# Altium schematic sheet Nahid's.SchDoc
size A3; SheetNumber: 1; SheetTotal: 1
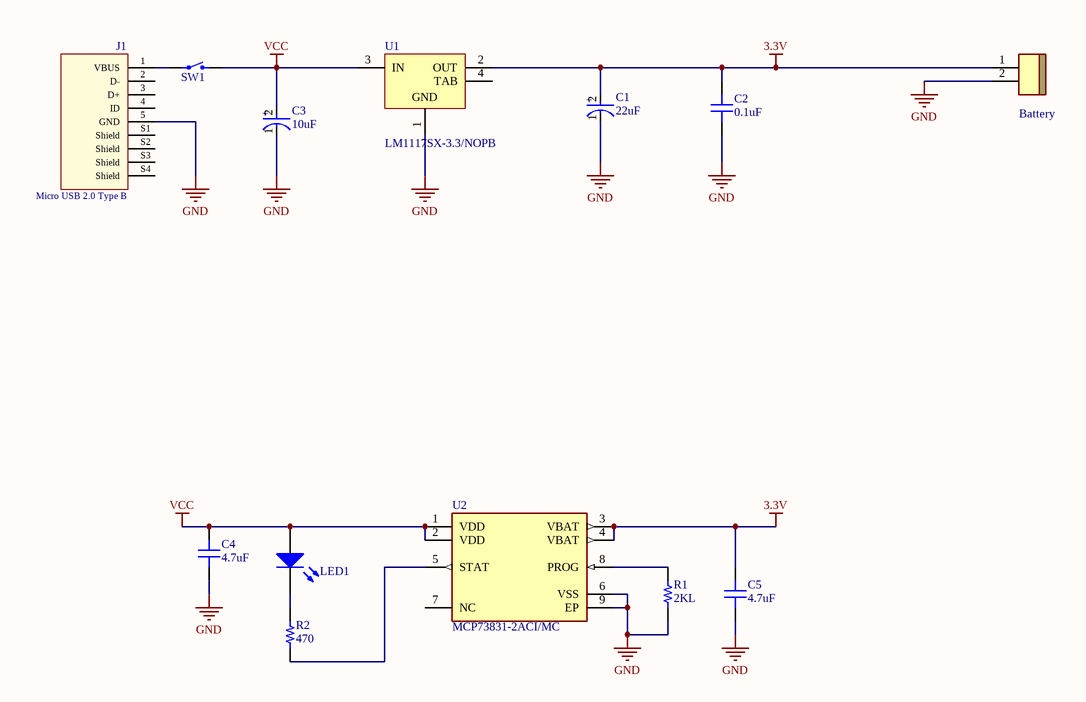
[diagram p0: Nahid's.SchDoc]

## Parts
Battery  Battery  [JST B2B-PH-K]  (value not drawn)
C1  22uF  [FP-EEH-G-MFG]
C2  0.1uF  [CAP 0603_1608]
C3  10uF  [FP-EEH-G-MFG]
C4  4.7uF  [CAP 0603_1608]
C5  4.7uF  [CAP 0603_1608]
J1  Micro USB 2.0 Type B  [629105150521]
LED1  LED SMD 0603 BLUE  [LED_0603_RED]  (value not drawn)
R1  2KL  [RES 0402_1005]
R2  470  [RES 0402_1005]
SW1  Tactile 2PIN 6X3.5mm H4.57mm (SMD)  [SWPBS_SPST_6X3X5]  (value not drawn)
U1  LM1117SX-3.3/NOPB  [KTT0003B_N]
U2  MCP73831-2ACI/MC  [FP-C04-123-MFG]

## Nets
3.3V: Battery.1 C1.2(A) C2.2 C5.2 U1.2(OUT) U2.3(VBAT) U2.4(VBAT)
GND: Battery.2 C1.1(C) C2.1 C3.1(C) C4.1 C5.1 J1.5(GND) R1.1 U1.1(GND) U2.6(VSS) U2.9(EP)
VCC: C3.2(A) C4.2 LED1.1(A) SW1.2 U1.3(IN) U2.1(VDD) U2.2(VDD)
NetJ1_1: J1.1(VBUS) SW1.1
NetLED1_2: LED1.2(K) R2.2
NetR1_2: R1.2 U2.8(PROG)
NetR2_1: R2.1 U2.5(STAT)

Not connected (* = marked no-connect by the designer): J1 2(D-) 3(D+) 4(ID) S1(Shield) S2(Shield) S3(Shield) S4(Shield); U1 4(TAB); U2 7(NC)

## Notes on the sheet
- (in symbol CMP-05428-000644-1) +

## Library data of the parts
Battery = JST BxB-PH-K 2Pin: Connector Header Through Hole 0.079" (2.00mm); PartNumber: B2B-PH-K-S(LF)(SN)
C1 C3 = CMP-05428-000644-1: Conductive Polymer Hybrid Aluminum Electrolytic Capacitors 470uF ±20% 25V RADIAL SMT 10x10.2mm; ESR (Equivalent Series Resistance): 20mR; Life (Hours): 4000Hour; Resistor Type: Hybrid; Mount: Surface Mount; Packaging: Cut Tape; RoHS Compliant: Yes; Voltage Rating: 25V; Tolerance: 20%; Ratings: AEC-Q200; Max Operating Temperature: 125°C; Capacitance: 470uF; Case/Package: Radial; Min Operating Temperature: -55°C
C2 C4 C5 = Cap 0603: SMT Capacitor; VALUE: 100nF
J1 = Micro USB 2.0 Type B Horizontal (SMD) 629105150521: Micro USB 2.0 Type B Horizontal SMT 5 Contacts High Current WR-COM; Rated Current: 3 A; Gender: Female; ComponentLink1Description: Manufacturer; ComponentLink1URL: http://www.we-online.de; ComponentLink2Description: Datasheet; ComponentLink2URL: http://katalog.we-online.de/em/datasheet/629105150521.pdf; PartNumber: 629105150521; Published Date: May 2018; Publisher: Wurth Elektronik; Orientation: Horizontal; Interface Type: Micro USB 2.0 Type B; Operating Temperature: -40 to 85 degC; Mounting Technology: SMT; Packaging: Tape and Reel
R1 R2 = Res 0402: SMT Resistor; VALUE: 1K
SW1 = Tactile 2PIN 6X3.5mm H4.57mm (SMD): Tactile Switch SPST-NO Top Actuated Surface Mount; PartNumber: FSMSMTR-ND
U1 = CMP-0062-00678-5: 800mA Low-Dropout Linear Regulator, 3-pin TO-263, Pb-Free; Manufacturer: Texas Instruments; CompType: LDO IC; PowerWise: N; PackageTopMarking: NSUZXYTTE#*LM1117S*3.3; High-Reliability: Y; PartNumber: LM1117SX-3.3/NOPB; RoHS: Y; ComponentLink1URL: http://www.ti.com/general/docs/lit/getliterature.tsp?genericPartNumber=LM1117&fileType=pdf; PackageDescription: TO-263, Molded, .400 x .390 x .180in, 3 Lead, .1in Pitch, Surface Mount; PackageReference: KTT0003B; Code_JEDEC: MO-169-AA; PinCount: 3; ComponentLink1Description: Datasheet URL
U2 = CMP-06318-000002-1: IC CONTROLLER LI-ION 4.2V 8DFN; Manufacturer: Microchip; Number Of Cells: 1; Min Supply Voltage: 3.75V; Standoff Height: 0mm; Nominal Supply Current: 0.1-510uA; Max Junction Temp: +125°C; Max Supply Voltage: 6V; Description: Charger IC Lithium Ion/Polymer 8-DFN (2x3); Temperature Range High: +85°C; Mouser Description: Battery Management Li-Ion/Li-Poly Charg Mgnt 4.2V Vreg out; Device Class L2: Power Management ICs; ComponentLink2Description: Datasheet; Footprint Url: http://ww1.microchip.com/downloads/en/DeviceDoc/8L_DFN_2x3x0_9_MC_C04-123C.pdf; Output Voltage: 4.2V; ComponentLink2URL: http://ww1.microchip.com/downloads/en/DeviceDoc/20001984g.pdf; Package: C04-123; Ipc Land Pattern Name: DFN200X300X90-8; Number Of Outputs: 1; Manufacturer Part Number: MCP73831-2ACI/MC; Device Class L3: Battery Management; Device Class L1: Integrated Circuits (ICs); Digikey Description: IC CONTROLLER LI-ION 4.2V 8DFN; Category: IC; Temperature Range Low: -40°C; Automotive: No; Temperature: -40°C to +85°C; Octopart: https://octopart.com/mcp73831-2aci%2Fmc-microchip-16517355; RoHS: TRUE; Ambient Temperature Range Low: -40°C; Height: 1mm; Lead Free: Yes; Ambient Temperature Range High: +85°C